# Altium schematic sheet S7CAS-PLEIADES-CARTE-MERE_Pxx_FPGA_bank0_1_5.SchDoc
size Tabloid; Date: Date; Author: Author 1; Revision: 1; SheetNumber: 3; SheetTotal: 18; Size: 11x17; Sheet_Name: BANK 0, 1 & 5
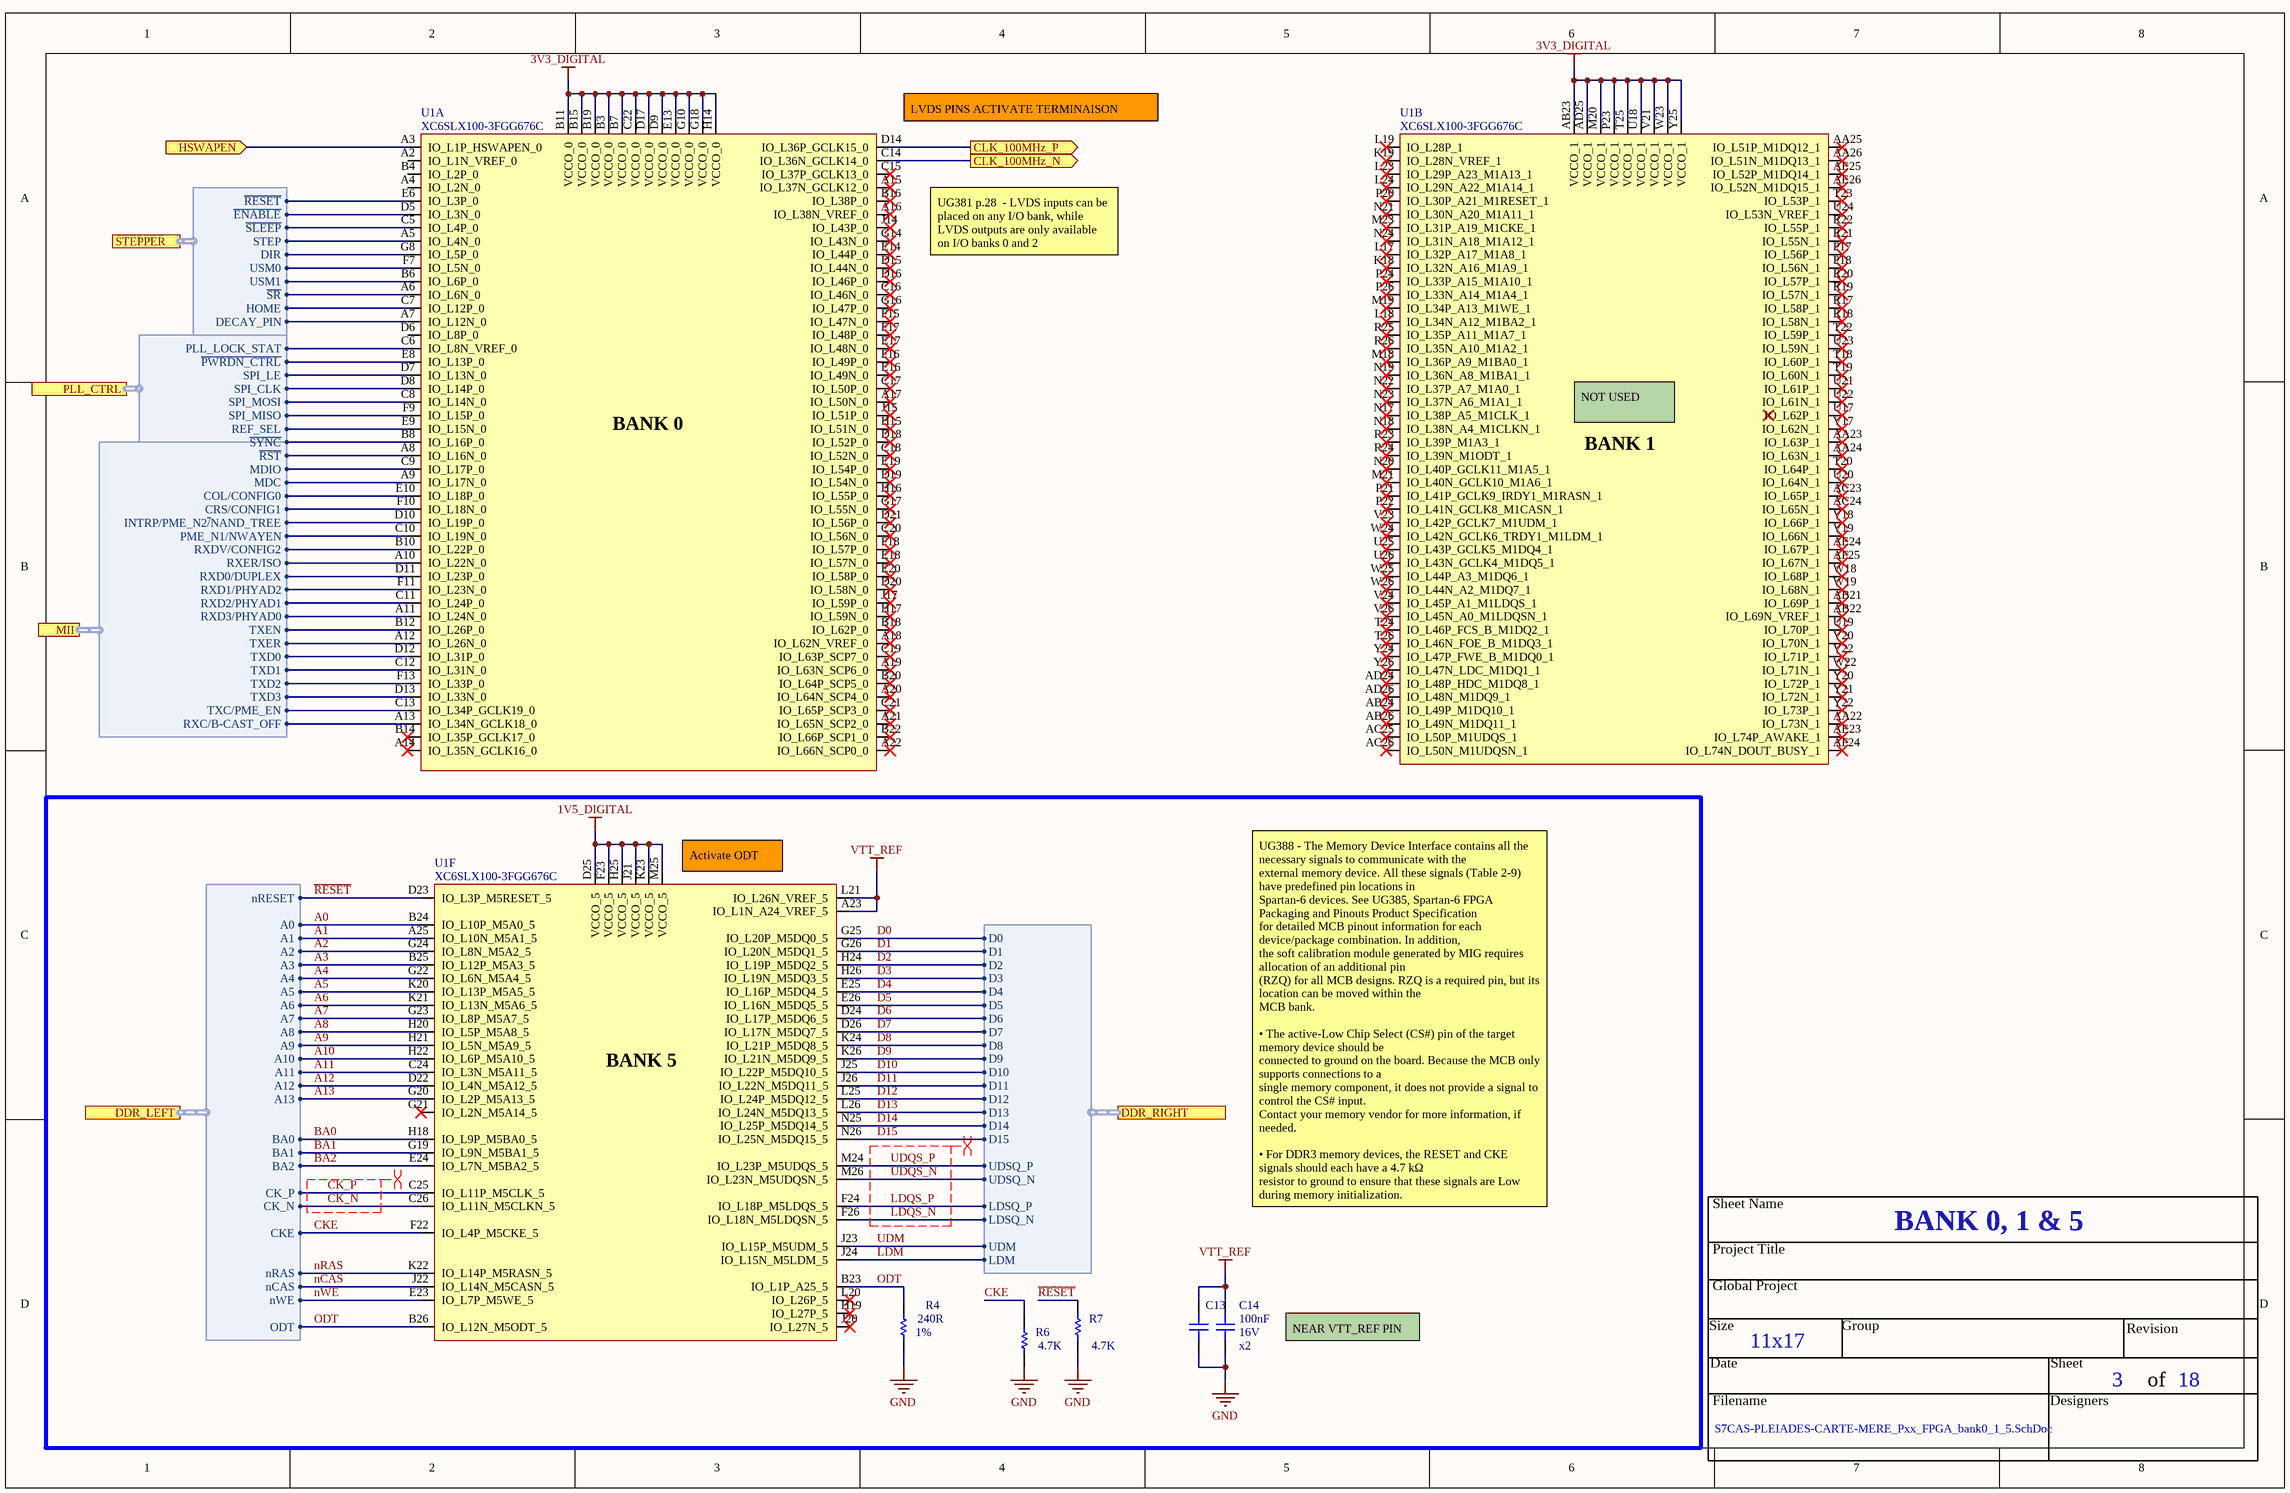
[diagram p0: S7CAS-PLEIADES-CARTE-MERE_Pxx_FPGA_bank0_1_5.SchDoc]

## Parts
C13  CAP - 0603  [CAP_0603]  (value not drawn)
C14  value 100nF  Voltage: 16V  [CAP_0603]  (hidden comment: CAP - 0603)
R4  value 240R  Precision: 1%  [RES_0603]  (hidden comment: RES - 0603)
R6  value 4.7K  [RES_0603]  (hidden comment: RES - 0603)
R7  value 4.7K  [RES_0603]  (hidden comment: RES - 0603)
U1  XC6SLX100-3FGG676C  [FPGA_XILINX_FGG676]  (parts A,B,F of 10)

## Blocks framed on the sheet
x2: C13 C14 R4 R6 R7 U1

## Ports
CLK_100MHz_N (out, see S7CAS-PLEIADES-CARTE-MERE_Pxx_FLASH_PHY_CLOCK[5A]), CLK_100MHz_P (out, see S7CAS-PLEIADES-CARTE-MERE_Pxx_FLASH_PHY_CLOCK[5A]), DDR_LEFT (harness ddr_left, see S7CAS-PLEIADES-CARTE-MERE_Pxx_DDR[1B]), DDR_RIGHT (harness ddr_right, see S7CAS-PLEIADES-CARTE-MERE_Pxx_DDR[4B]), HSWAPEN (in, see S7CAS-PLEIADES-CARTE-MERE_Pxx_FPGA_bank2_4[1D]), MII (harness MII - Harness, see S7CAS-PLEIADES-CARTE-MERE_Pxx_PHY[1C]), PLL_CTRL (harness PLL_CTRL, see S7CAS-PLEIADES-CARTE-MERE_Pxx_FLASH_PHY_CLOCK[2B]), STEPPER (harness STEPPER_MOTOR_DRIVER_HARNESS, see S7CAS-PLEIADES-CARTE-MERE_Pxx_MOTEUR[4B])

## Harnesses
ddr_left: ODT, nRAS, nCAS, nWE, CKE, CK_P, CK_N, BA0, BA1, BA2, A0, A1, A2, A3, A4, A5, A6, A7, A8, A9, A10, A11, A12, A13, nRESET
ddr_right: D0, D1, D2, D3, D4, D5, D6, D7, D8, D9, D10, D11, D12, D13, D14, D15, UDSQ_P, UDSQ_N, LDSQ_N, LDSQ_P, UDM, LDM
MII - Harness: ~{RST}, MDIO, MDC, COL/CONFIG0, CRS/CONFIG1, INTRP/PME_N2~{/}NAND_TREE, PME_N1/NWAYEN, RXDV/CONFIG2, RXER/ISO, RXD0/DUPLEX, RXD1/PHYAD2, RXD2/PHYAD1, RXD3/PHYAD0, RXC/B-CAST_OFF, TXEN, TXER, TXD0, TXD1, TXD2, TXD3, TXC/PME_EN
PLL_CTRL: ~{PWRDN_CTRL}, SPI_LE, SPI_CLK, SPI_MOSI, SPI_MISO, REF_SEL, ~{SYNC}, PLL_LOCK_STAT
STEPPER_MOTOR_DRIVER_HARNESS: ~{RESET}, ~{ENABLE}, ~{SLEEP}, STEP, DIR, USM0, USM1, ~{SR}, HOME, DECAY_PIN

## Nets
1V5_DIGITAL: U1.D25(VCCO_5) U1.F23(VCCO_5) U1.H25(VCCO_5) U1.J21(VCCO_5) U1.K23(VCCO_5) U1.M25(VCCO_5)
3V3_DIGITAL: U1.AB23(VCCO_1) U1.AD25(VCCO_1) U1.B3(VCCO_0) U1.B7(VCCO_0) U1.B11(VCCO_0) U1.B15(VCCO_0) U1.B19(VCCO_0) U1.C22(VCCO_0) U1.D9(VCCO_0) U1.D17(VCCO_0) U1.E13(VCCO_0) U1.G10(VCCO_0) U1.G18(VCCO_0) U1.H14(VCCO_0) U1.M20(VCCO_1) U1.P23(VCCO_1) U1.T25(VCCO_1) U1.U18(VCCO_1) U1.V21(VCCO_1) U1.W23(VCCO_1) U1.Y25(VCCO_1)
GND: C13.1 C14.1 R4.1 R6.1 R7.1
VTT_REF: C13.2 C14.2 U1.A23(IO_L1N_A24_VREF_5) U1.L21(IO_L26N_VREF_5)
~{RESET}: R7.2 U1.D23(IO_L3P_M5RESET_5) ; port DDR_LEFT.nRESET
A0: U1.B24(IO_L10P_M5A0_5) ; port DDR_LEFT.A0
A1: U1.A25(IO_L10N_M5A1_5) ; port DDR_LEFT.A1
A2: U1.G24(IO_L8N_M5A2_5) ; port DDR_LEFT.A2
A3: U1.B25(IO_L12P_M5A3_5) ; port DDR_LEFT.A3
A4: U1.G22(IO_L6N_M5A4_5) ; port DDR_LEFT.A4
A5: U1.K20(IO_L13P_M5A5_5) ; port DDR_LEFT.A5
A6: U1.K21(IO_L13N_M5A6_5) ; port DDR_LEFT.A6
A7: U1.G23(IO_L8P_M5A7_5) ; port DDR_LEFT.A7
A8: U1.H20(IO_L5P_M5A8_5) ; port DDR_LEFT.A8
A9: U1.H21(IO_L5N_M5A9_5) ; port DDR_LEFT.A9
A10: U1.H22(IO_L6P_M5A10_5) ; port DDR_LEFT.A10
A11: U1.C24(IO_L3N_M5A11_5) ; port DDR_LEFT.A11
A12: U1.D22(IO_L4N_M5A12_5) ; port DDR_LEFT.A12
A13: U1.G20(IO_L2P_M5A13_5) ; port DDR_LEFT.A13
BA0: U1.H18(IO_L9P_M5BA0_5) ; port DDR_LEFT.BA0
BA1: U1.G19(IO_L9N_M5BA1_5) ; port DDR_LEFT.BA1
BA2: U1.E24(IO_L7N_M5BA2_5) ; port DDR_LEFT.BA2
CK_N: U1.C26(IO_L11N_M5CLKN_5) ; port DDR_LEFT.CK_N
CK_P: U1.C25(IO_L11P_M5CLK_5) ; port DDR_LEFT.CK_P
CKE: R6.2 U1.F22(IO_L4P_M5CKE_5) ; port DDR_LEFT.CKE
CLK_100MHz_N: U1.C14(IO_L36N_GCLK14_0) ; port CLK_100MHz_N
CLK_100MHz_P: U1.D14(IO_L36P_GCLK15_0) ; port CLK_100MHz_P
D0: U1.G25(IO_L20P_M5DQ0_5) ; port DDR_RIGHT.D0
D1: U1.G26(IO_L20N_M5DQ1_5) ; port DDR_RIGHT.D1
D2: U1.H24(IO_L19P_M5DQ2_5) ; port DDR_RIGHT.D2
D3: U1.H26(IO_L19N_M5DQ3_5) ; port DDR_RIGHT.D3
D4: U1.E25(IO_L16P_M5DQ4_5) ; port DDR_RIGHT.D4
D5: U1.E26(IO_L16N_M5DQ5_5) ; port DDR_RIGHT.D5
D6: U1.D24(IO_L17P_M5DQ6_5) ; port DDR_RIGHT.D6
D7: U1.D26(IO_L17N_M5DQ7_5) ; port DDR_RIGHT.D7
D8: U1.K24(IO_L21P_M5DQ8_5) ; port DDR_RIGHT.D8
D9: U1.K26(IO_L21N_M5DQ9_5) ; port DDR_RIGHT.D9
D10: U1.J25(IO_L22P_M5DQ10_5) ; port DDR_RIGHT.D10
D11: U1.J26(IO_L22N_M5DQ11_5) ; port DDR_RIGHT.D11
D12: U1.L25(IO_L24P_M5DQ12_5) ; port DDR_RIGHT.D12
D13: U1.L26(IO_L24N_M5DQ13_5) ; port DDR_RIGHT.D13
D14: U1.N25(IO_L25P_M5DQ14_5) ; port DDR_RIGHT.D14
D15: U1.N26(IO_L25N_M5DQ15_5) ; port DDR_RIGHT.D15
HSWAPEN: U1.A3(IO_L1P_HSWAPEN_0) ; port HSWAPEN
LDM: U1.J24(IO_L15N_M5LDM_5) ; port DDR_RIGHT.LDM
LDQS_N: U1.F26(IO_L18N_M5LDQSN_5) ; port DDR_RIGHT.LDSQ_N
LDQS_P: U1.F24(IO_L18P_M5LDQS_5) ; port DDR_RIGHT.LDSQ_P
nCAS: U1.J22(IO_L14N_M5CASN_5) ; port DDR_LEFT.nCAS
nRAS: U1.K22(IO_L14P_M5RASN_5) ; port DDR_LEFT.nRAS
nWE: U1.E23(IO_L7P_M5WE_5) ; port DDR_LEFT.nWE
ODT: R4.2 U1.B23(IO_L1P_A25_5) U1.B26(IO_L12N_M5ODT_5) ; port DDR_LEFT.ODT
UDM: U1.J23(IO_L15P_M5UDM_5) ; port DDR_RIGHT.UDM
UDQS_N: U1.M26(IO_L23N_M5UDQSN_5) ; port DDR_RIGHT.UDSQ_N
UDQS_P: U1.M24(IO_L23P_M5UDQS_5) ; port DDR_RIGHT.UDSQ_P
NetU1_A5: U1.A5(IO_L4N_0) ; port STEPPER.STEP
NetU1_A6: U1.A6(IO_L6N_0) ; port STEPPER.~{SR}
NetU1_A7: U1.A7(IO_L12N_0) ; port STEPPER.DECAY_PIN
NetU1_A8: U1.A8(IO_L16N_0) ; port MII.~{RST}
NetU1_A9: U1.A9(IO_L17N_0) ; port MII.MDC
NetU1_A10: U1.A10(IO_L22N_0) ; port MII.RXER/ISO
NetU1_A11: U1.A11(IO_L24N_0) ; port MII.RXD3/PHYAD0
NetU1_A12: U1.A12(IO_L26N_0) ; port MII.TXER
NetU1_A13: U1.A13(IO_L34N_GCLK18_0) ; port MII.RXC/B-CAST_OFF
NetU1_B6: U1.B6(IO_L6P_0) ; port STEPPER.USM1
NetU1_B8: U1.B8(IO_L16P_0) ; port PLL_CTRL.~{SYNC}
NetU1_B10: U1.B10(IO_L22P_0) ; port MII.RXDV/CONFIG2
NetU1_B12: U1.B12(IO_L26P_0) ; port MII.TXEN
NetU1_C5: U1.C5(IO_L4P_0) ; port STEPPER.~{SLEEP}
NetU1_C6: U1.C6(IO_L8N_VREF_0) ; port PLL_CTRL.PLL_LOCK_STAT
NetU1_C7: U1.C7(IO_L12P_0) ; port STEPPER.HOME
NetU1_C8: U1.C8(IO_L14N_0) ; port PLL_CTRL.SPI_MOSI
NetU1_C9: U1.C9(IO_L17P_0) ; port MII.MDIO
NetU1_C10: U1.C10(IO_L19N_0) ; port MII.PME_N1/NWAYEN
NetU1_C11: U1.C11(IO_L24P_0) ; port MII.RXD2/PHYAD1
NetU1_C12: U1.C12(IO_L31N_0) ; port MII.TXD1
NetU1_C13: U1.C13(IO_L34P_GCLK19_0) ; port MII.TXC/PME_EN
NetU1_D5: U1.D5(IO_L3N_0) ; port STEPPER.~{ENABLE}
NetU1_D7: U1.D7(IO_L13N_0) ; port PLL_CTRL.SPI_LE
NetU1_D8: U1.D8(IO_L14P_0) ; port PLL_CTRL.SPI_CLK
NetU1_D10: U1.D10(IO_L19P_0) ; port MII.INTRP/PME_N2~{/}NAND_TREE
NetU1_D11: U1.D11(IO_L23P_0) ; port MII.RXD0/DUPLEX
NetU1_D12: U1.D12(IO_L31P_0) ; port MII.TXD0
NetU1_D13: U1.D13(IO_L33N_0) ; port MII.TXD3
NetU1_E6: U1.E6(IO_L3P_0) ; port STEPPER.~{RESET}
NetU1_E8: U1.E8(IO_L13P_0) ; port PLL_CTRL.~{PWRDN_CTRL}
NetU1_E9: U1.E9(IO_L15N_0) ; port PLL_CTRL.REF_SEL
NetU1_E10: U1.E10(IO_L18P_0) ; port MII.COL/CONFIG0
NetU1_F7: U1.F7(IO_L5N_0) ; port STEPPER.USM0
NetU1_F9: U1.F9(IO_L15P_0) ; port PLL_CTRL.SPI_MISO
NetU1_F10: U1.F10(IO_L18N_0) ; port MII.CRS/CONFIG1
NetU1_F11: U1.F11(IO_L23N_0) ; port MII.RXD1/PHYAD2
NetU1_F13: U1.F13(IO_L33P_0) ; port MII.TXD2
NetU1_G8: U1.G8(IO_L5P_0) ; port STEPPER.DIR

Not connected (* = marked no-connect by the designer): U1 A2(IO_L1N_VREF_0) A4(IO_L2N_0) A14(IO_L35N_GCLK16_0)* A15(IO_L37N_GCLK12_0)* A16(IO_L38N_VREF_0)* A17(IO_L50N_0)* A18(IO_L62N_VREF_0)* A19(IO_L63N_SCP6_0)* A20(IO_L64N_SCP4_0)* A21(IO_L65N_SCP2_0)* A22(IO_L66N_SCP0_0)* AA22(IO_L73N_1)* AA23(IO_L63P_1)* AA24(IO_L63N_1)* AA25(IO_L51P_M1DQ12_1)* AA26(IO_L51N_M1DQ13_1)* AB21(IO_L69P_1)* AB22(IO_L69N_VREF_1)* AB24(IO_L49P_M1DQ10_1)* AB26(IO_L49N_M1DQ11_1)* AC23(IO_L65P_1)* AC24(IO_L65N_1)* AC25(IO_L50P_M1UDQS_1)* AC26(IO_L50N_M1UDQSN_1)* AD24(IO_L48P_HDC_M1DQ8_1)* AD26(IO_L48N_M1DQ9_1)* AE23(IO_L74P_AWAKE_1)* AE24(IO_L67P_1)* AE25(IO_L52P_M1DQ14_1)* AE26(IO_L52N_M1DQ15_1)* AF24(IO_L74N_DOUT_BUSY_1)* AF25(IO_L67N_1)* B4(IO_L2P_0) B14(IO_L35P_GCLK17_0)* B16(IO_L38P_0)* B18(IO_L62P_0)* B20(IO_L64P_SCP5_0)* B22(IO_L66P_SCP1_0)* C15(IO_L37P_GCLK13_0)* C16(IO_L46N_0)* C17(IO_L50P_0)* C18(IO_L52N_0)* C19(IO_L63P_SCP7_0)* C20(IO_L56N_0)* C21(IO_L65P_SCP3_0)* D6(IO_L8P_0) D15(IO_L44N_0)* D16(IO_L46P_0)* D18(IO_L52P_0)* D19(IO_L54N_0)* D20(IO_L58N_0)* D21(IO_L56P_0)* E14(IO_L44P_0)* E16(IO_L49N_0)* E17(IO_L48N_0)* E18(IO_L57N_0)* E19(IO_L54P_0)* E20(IO_L58P_0)* F15(IO_L47N_0)* F16(IO_L49P_0)* F17(IO_L48P_0)* F18(IO_L57P_0)* G14(IO_L43N_0)* G16(IO_L47P_0)* G17(IO_L55N_0)* G21(IO_L2N_M5A14_5)* H15(IO_L51N_0)* H16(IO_L55P_0)* H17(IO_L59N_0)* H19(IO_L27P_5)* J14(IO_L43P_0)* J15(IO_L51P_0)* J17(IO_L59P_0)* J20(IO_L27N_5)* K18(IO_L32N_A16_M1A9_1)* K19(IO_L28N_VREF_1)* L17(IO_L32P_A17_M1A8_1)* L18(IO_L34N_A12_M1BA2_1)* L19(IO_L28P_1)* L20(IO_L26P_5)* L23(IO_L29P_A23_M1A13_1)* L24(IO_L29N_A22_M1A14_1)* M18(IO_L36P_A9_M1BA0_1)* M19(IO_L34P_A13_M1WE_1)* M21(IO_L40N_GCLK10_M1A6_1)* M23(IO_L31P_A19_M1CKE_1)* N17(IO_L38P_A5_M1CLK_1)* N18(IO_L38N_A4_M1CLKN_1)* N19(IO_L36N_A8_M1BA1_1)* N20(IO_L40P_GCLK11_M1A5_1)* N21(IO_L30N_A20_M1A11_1)* N22(IO_L37P_A7_M1A0_1)* N23(IO_L37N_A6_M1A1_1)* N24(IO_L31N_A18_M1A12_1)* P17(IO_L56P_1)* P18(IO_L56N_1)* P20(IO_L30P_A21_M1RESET_1)* P21(IO_L41P_GCLK9_IRDY1_M1RASN_1)* P22(IO_L41N_GCLK8_M1CASN_1)* P24(IO_L33P_A15_M1A10_1)* P26(IO_L33N_A14_M1A4_1)* R17(IO_L58P_1)* R18(IO_L58N_1)* R19(IO_L57N_1)* R20(IO_L57P_1)* R21(IO_L55N_1)* R22(IO_L55P_1)* R23(IO_L39P_M1A3_1)* R24(IO_L39N_M1ODT_1)* R25(IO_L35P_A11_M1A7_1)* R26(IO_L35N_A10_M1A2_1)* T18(IO_L60P_1)* T19(IO_L60N_1)* T20(IO_L64P_1)* T22(IO_L59P_1)* T23(IO_L53P_1)* T24(IO_L46P_FCS_B_M1DQ2_1)* T26(IO_L46N_FOE_B_M1DQ3_1)* U17(IO_L62P_1)* U19(IO_L70P_1)* U20(IO_L64N_1)* U21(IO_L61P_1)* U22(IO_L61N_1)* U23(IO_L59N_1)* U24(IO_L53N_VREF_1)* U25(IO_L43P_GCLK5_M1DQ4_1)* U26(IO_L43N_GCLK4_M1DQ5_1)* V17(IO_L62N_1)* V18(IO_L66P_1)* V19(IO_L66N_1)* V20(IO_L70N_1)* V22(IO_L71P_1)* V23(IO_L42P_GCLK7_M1UDM_1)* V24(IO_L45P_A1_M1LDQS_1)* V26(IO_L45N_A0_M1LDQSN_1)* W18(IO_L68P_1)* W19(IO_L68N_1)* W22(IO_L71N_1)* W24(IO_L42N_GCLK6_TRDY1_M1LDM_1)* W25(IO_L44P_A3_M1DQ6_1)* W26(IO_L44N_A2_M1DQ7_1)* Y20(IO_L72P_1)* Y21(IO_L72N_1)* Y22(IO_L73P_1)* Y24(IO_L47P_FWE_B_M1DQ0_1)* Y26(IO_L47N_LDC_M1DQ1_1)*

## Layout directives
differential pair; differential pair class DDR_CK_PAIR: CK_N, CK_P
differential pair; differential pair class DQS_DIFF_PAIR: LDQS_N, LDQS_P, UDQS_N, UDQS_P

## Notes on the sheet
- (near U1) LVDS PINS ACTIVATE TERMINAISON
- UG381 p.28  - LVDS inputs can be placed on any I/O bank, while
  LVDS outputs are only available on I/O banks 0 and 2
- (near U1) NOT USED
- (near U1) Activate ODT
- UG388 - The Memory Device Interface contains all the necessary signals to communicate with the
  external memory device. All these signals (Table 2-9) have predefined pin locations in
  Spartan-6 devices. See UG385, Spartan-6 FPGA Packaging and Pinouts Product Specification
  for detailed MCB pinout information for each device/package combination. In addition,
  the soft calibration module generated by MIG requires allocation of an additional pin
  (RZQ) for all MCB designs. RZQ is a required pin, but its location can be moved within the
  MCB bank.
  • The active-Low Chip Select (CS#) pin of the target memory device should be
  connected to ground on the board. Because the MCB only supports connections to a
  single memory component, it does not provide a signal to control the CS# input.
  Contact your memory vendor for more information, if needed.
  • For DDR3 memory devices, the RESET and CKE signals should each have a 4.7 kΩ
  resistor to ground to ensure that these signals are Low during memory initialization.
- NEAR VTT_REF PIN
- Sheet Name
- Project Title
- Global Project
- Revision
- Size
- Date
- Group
- Sheet
- of
- Filename
- Designers
- (in symbol FPGA_XC6SLX100-3FGG676C, part A) BANK 0
- (in symbol FPGA_XC6SLX100-3FGG676C, part B) BANK 1
- (in symbol FPGA_XC6SLX100-3FGG676C, part F) BANK 5

## Library data of the parts
C13 = CAP - 0603: Precision: 10%; Voltage: 16V; Value: 100nF; Current: *; CreatedBy: Jonathan Bouchard; Power: *; Package: 0603; Supplier 1: Arrow Electronics; Supplier Part Number 1: CL10B104KO8NNNC
C14 = CAP - 0603: Precision: 10%; Current: *; CreatedBy: Jonathan Bouchard; Power: *; Package: 0603; Supplier 1: Arrow Electronics; Supplier Part Number 1: CL10B104KO8NNNC
R6 R7 = RES - 0603: Precision: 1%; Current: *; CreatedBy: Jonathan Bouchard; Package: 0603; Supplier 1: Arrow Electronics; Supplier Part Number 1: RMCF0603FT4K70
U1 = FPGA_XC6SLX100-3FGG676C: FPGA - XILINX SPARTAN 6 480 I/O - BGA-676; Voltage: 1.14 V ~ 1.26 V; Current: *; Power: *; Mfg: Xilinx; Mfg Part Number: XC6SLX100-3FGG676C; HelpURL: https://www.xilinx.com/support/documentation/data_sheets/ds162.pdf; CreatedBy: Jonathan Bouchard; Temperature: 0°C ~ 85°C (TJ); Value: *; Precision: *; Package: BGA-676; Supplier 1: Digikey; Supplier Part Number 1: 122-1760-ND
R4 = RES - 0603: Current: *; CreatedBy: Jonathan Bouchard; Package: 0603; Supplier 1: Arrow Electronics; Supplier Part Number 1: RMCF0603FT240R